# Altium schematic sheet USB_power.SchDoc
size A4
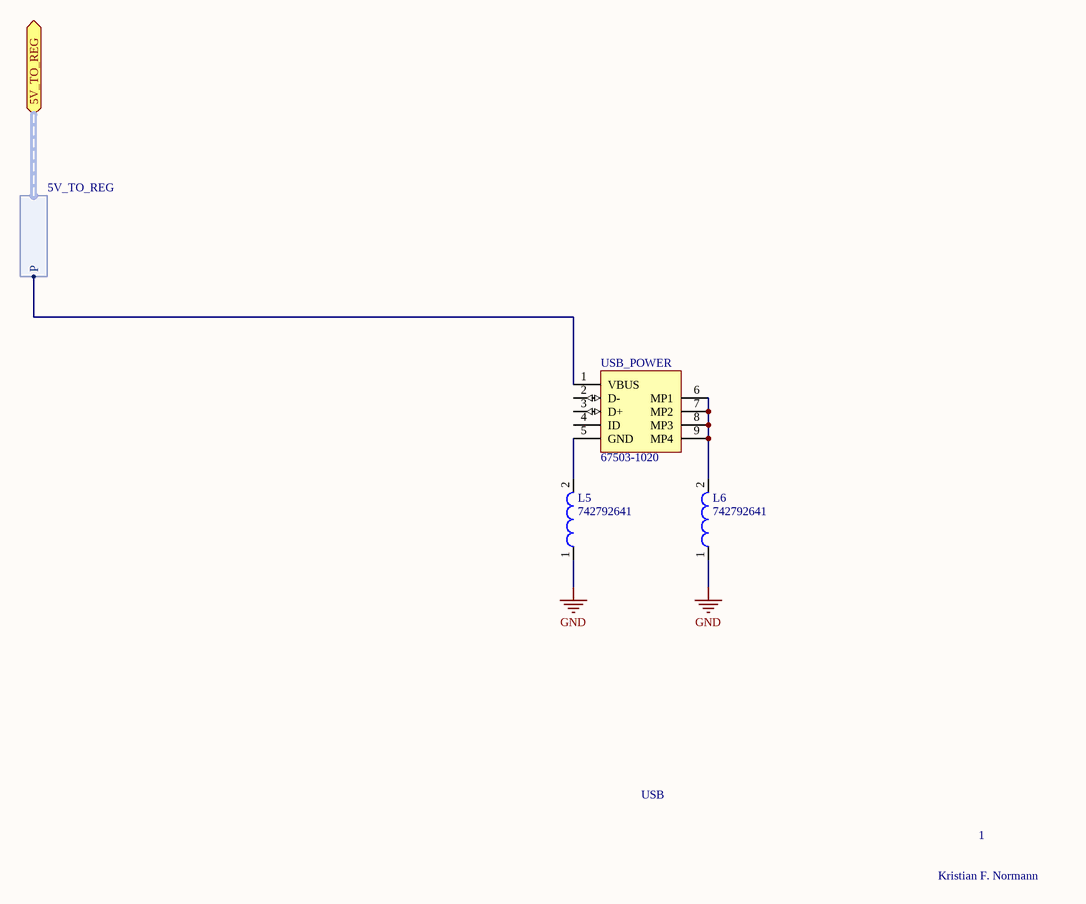
[diagram p0: USB_power.SchDoc]

## Parts
L5  742792641  [SMD-0603]
L6  742792641  [SMD-0603]
USB_POWER  67503-1020  [MOLX-67503-1020_V]

## Ports
5V_TO_REG (harness 5V_TO_REG)

## Harnesses
5V_TO_REG: P

## Nets
GND: L5.1 L6.1
NetL5_2: L5.2 USB_POWER.5(GND)
NetL6_2: L6.2 USB_POWER.6(MP1) USB_POWER.7(MP2) USB_POWER.8(MP3) USB_POWER.9(MP4)
NetUSB_POWER_1: USB_POWER.1(VBUS) ; port 5V_TO_REG.P

Not connected (* = marked no-connect by the designer): USB_POWER 2(D-) 3(D+) 4(ID)

## Notes on the sheet
- USB
- 1
- Kristian F. Normann

## Library data of the parts
L5 L6 = CMP-0220-00171-1: SMD EMI Suppression Ferrite Bead WE-CBF, Z = 300 Ohm; Impedance: 300 Ohm; PackageReference: SMD-0603; PackageVersion: 2009; ComponentLink2Description: Datasheet; ComponentLink2URL: http://www.we-online.de/katalog/media/pdf/742792641.pdf; ComponentLink1Description: Manufacturer Link; ComponentLink1URL: http://www.we-online.com; DatasheetVersion: Dec-2005; PackageDescription: Chip Inductor, 2-Leads, Body 1.6 x 0.8 mm
USB_POWER = CMP-0411-00002-1: USB, MINI, SMD, RA KME04-USBMU03A01; Manufacturer: Molex; ComponentLink1URL: http://www.molex.com/; PartNumber: 67503-1020; Mounting Technology: Surface Mount; ComponentLink1Description: Manufacturer URL; Terminal Pitch: 0.8 mm; DatasheetVersion: Rev F, 06/2009; ComponentLink2Description: Datasheet; PackageDescription: Mini USB Connector, SMT, Righer Angle; ComponentLink2URL: http://www.molex.com/pdm_docs/sd/675031020_sd.pdf; PackageReference: 67503-1020